# Altium schematic sheet weatherstation.SchDoc: Weather Station
size A4; CheckedBy: rrodrigu; Author: Satxo; CompanyName: Satxo; Revision: 0v1; SheetNumber: 8; SheetTotal: 8; ProjectName: Basestation
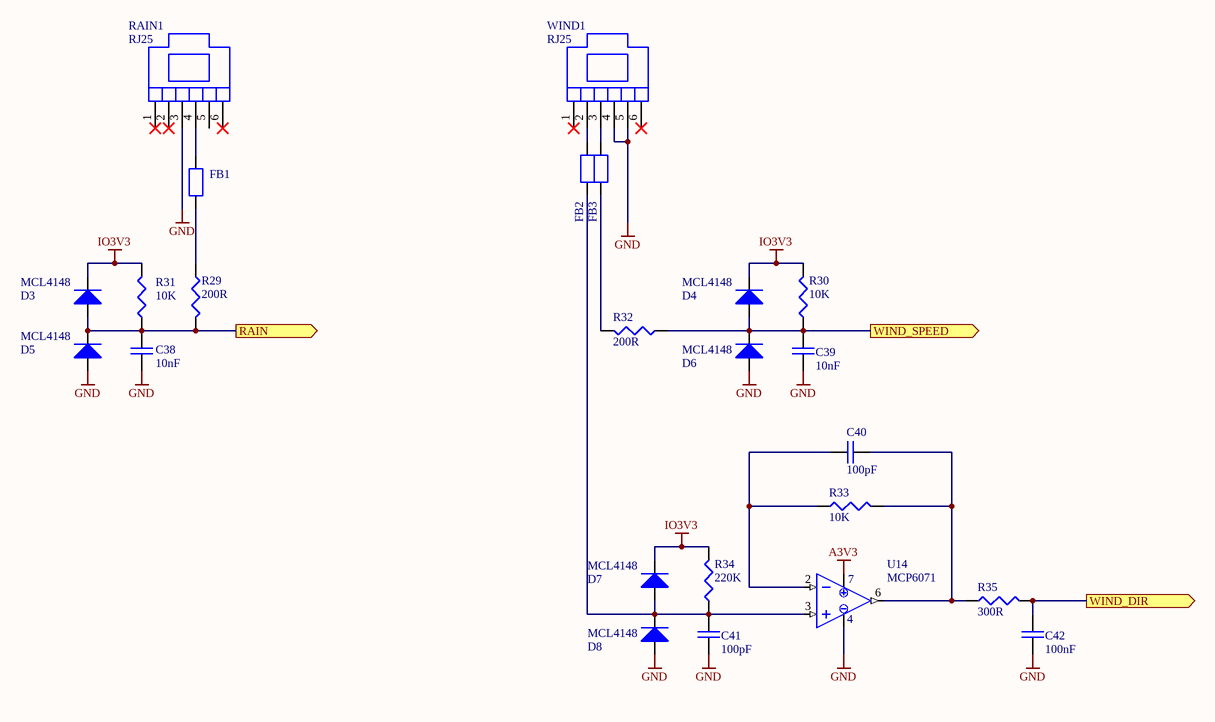
[diagram p0: weatherstation.SchDoc]

## Parts
C38  10nF  [0603]
C39  10nF  [0603]
C40  100pF  [0603]
C41  100pF  [0603]
C42  100nF  [0603]
D3  MCL4148  [0805@DIODE]
D4  MCL4148  [0805@DIODE]
D5  MCL4148  [0805@DIODE]
D6  MCL4148  [0805@DIODE]
D7  MCL4148  [0805@DIODE]
D8  MCL4148  [0805@DIODE]
FB1  150Z_100MHz  [0805]  (value not drawn)
FB2  150Z_100MHz  [0805]  (value not drawn)
FB3  150Z_100MHz  [0805]  (value not drawn)
R29  200R  [0603]
R30  10K  [0603]
R31  10K  [0603]
R32  200R  [0603]
R33  10K  [0603]
R34  220K  [0603]
R35  300R  [0603]
RAIN1  RJ25  [RJ25]
U14  MCP6071  [SOIC-8]
WIND1  RJ25  [RJ25]

## Ports
RAIN (out), WIND_DIR (out), WIND_SPEED (out)

## Nets
A3V3: U14.7(VDD)
GND: C38.1 C39.1 C41.1 C42.1 D5.A D6.A D8.A RAIN1.3 U14.4(VSS) WIND1.4 WIND1.5
IO3V3: D3.K D4.K D7.K R30.2 R31.2 R34.2
RAIN: C38.2 D3.A D5.K R29.2 R31.1 ; port RAIN
WIND_DIR: C42.2 R35.2 ; port WIND_DIR
WIND_SPEED: C39.2 D4.A D6.K R30.1 R32.1 ; port WIND_SPEED
NetC40_1: C40.1 R33.1 U14.2(INN)
NetC40_2: C40.2 R33.2 R35.1 U14.6(VOUT)
NetC41_2: C41.2 D7.A D8.K FB2.2 R34.1 U14.3(INP)
NetFB1_1: FB1.1 R29.1
NetFB1_2: FB1.2 RAIN1.4
NetFB2_1: FB2.1 WIND1.2
NetFB3_1: FB3.1 WIND1.3
NetFB3_2: FB3.2 R32.2

Not connected (* = marked no-connect by the designer): RAIN1 1* 2* 5 6*; WIND1 1* 6*

## Notes on the sheet
- Title
- Size:
- Date:
- A4
- Number:
- Time:
- Revision:
- Sheet
- of
- File:

## Library data of the parts
C38-C42 = CAP: Capacitor; Owner: Nuno Brum; Sub-Type: Ceramic; Assembly: INS; Maximum Voltage: *; Creation Date: 2005-04-28; Status: Valid; Validation date: 2006-05-15; Type: Capacitor
D3-D8 = Diode: Vishay Standard Avalanche Sinterglass Diode; Owner: Nuno Brum; Sub-Type: Generic; Assembly: INS; Validation date: 2006-05-15; Creation Date: 2001-06-05; Status: Valid; Model: MCL4148; Type: Diode
FB1-FB3 = FERRITE-BEAD-AXIAL: Ferrite bead; Sub-Type: Filter; Owner: Sergio Pires; Type: Electrical & Mechanical; Assembly: INS; Creation Date: 2005-10-20; Status: New
R29-R35 = RES: Resistor; Owner: Nuno Brum; Sub-Type: Generic; Assembly: INS; Validation date: 2006-05-15; Creation Date: 2002-07-17; Status: Valid; Power: *; Type: Resistor
RAIN1 WIND1 = RJ25: RJ25 Connector; Type: Connector; Creation Date: 2012-03-26
U14 = MCP6V26: Low-Offset Opamp; Type: IC; Creation Date: 2012-03-15